# Altium schematic sheet Power Monitor.SchDoc
size A4; SheetNumber: 3; SheetTotal: 5
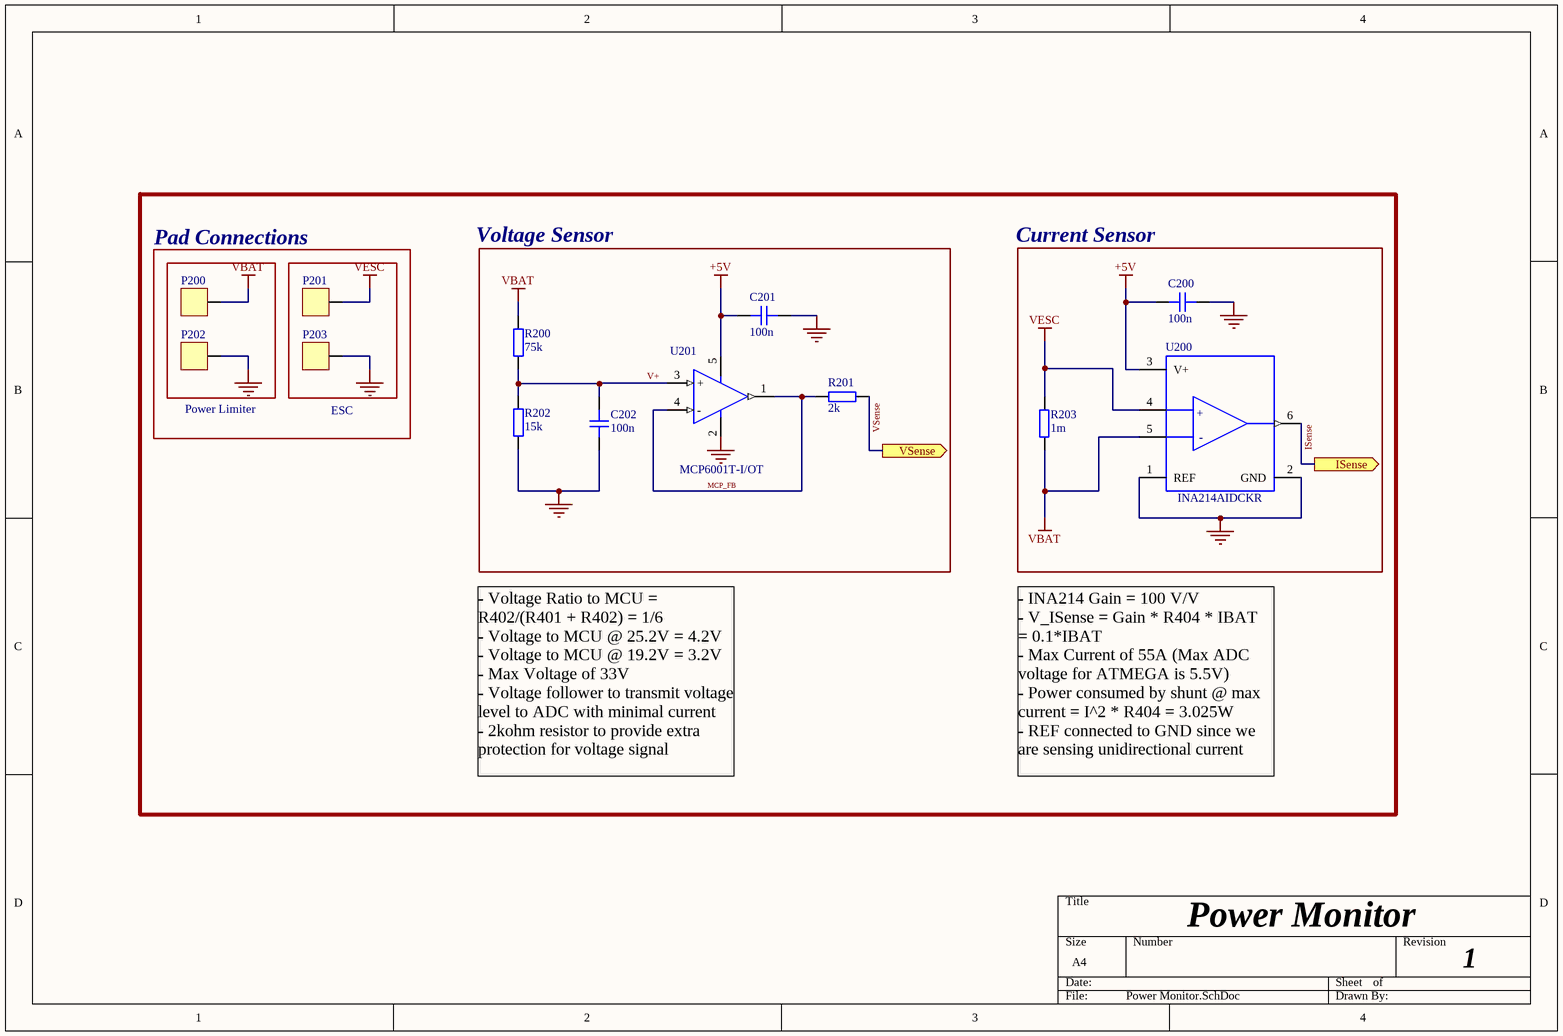
[diagram p0: Power Monitor.SchDoc]

## Parts
C200  100n  [CAP_0603]
C201  100n  [CAP_0603]
C202  100n  [CAP_0603]
P200  6mm x 6mm Solder Pad  [6mm x 6mm Solder Pad]  (value not drawn)
P201  6mm x 6mm Solder Pad  [6mm x 6mm Solder Pad]  (value not drawn)
P202  6mm x 6mm Solder Pad  [6mm x 6mm Solder Pad]  (value not drawn)
P203  6mm x 6mm Solder Pad  [6mm x 6mm Solder Pad]  (value not drawn)
R200  75k  [RES_0603]
R201  2k  [RES_0603]
R202  15k  [RES_0603]
R203  1m  [EBWM2512F1L00S9]
U200  INA214AIDCKR  [FP-DCK0006A-MFG]
U201  MCP6001T-I/OT  [MCP6001-I/OT]

## Blocks framed on the sheet
Voltage Sensor: C201 C202 R200-R202 U201
Pad Connections: P200-P203
Current Sensor: C200 R203 U200

## Ports
ISense (out, see Thrust Stand Controller Revised[3C], MCU[3B]), VSense (out, see Thrust Stand Controller Revised[3C], MCU[3C])

## Nets
+5V: C200.1 C201.1 U200.3(V+) U201.5
GND: C200.2 C201.2 C202.1 P202.1 P203.1 R202.2 U200.1(REF) U200.2(GND) U201.2
VBAT: P200.1 R200.1 R203.1 U200.5(IN-)
VESC: P201.1 R203.2 U200.4(IN+)
ISense: U200.6(VOUT) ; port ISense
MCP_FB: R201.1 U201.1 U201.4(-)
V+: C202.2 R200.2 R202.1 U201.3(+)
VSense: R201.2 ; port VSense

## Notes on the sheet
- (near P202) Power Limiter
- (near P203) ESC
- - Voltage Ratio to MCU = R402/(R401 + R402) = 1/6
  - Voltage to MCU @ 25.2V = 4.2V         - Voltage to MCU @ 19.2V = 3.2V            - Max Voltage of 33V                          - Voltage follower to transmit voltage level to ADC with minimal current                                                - 2kohm resistor to provide extra protection for voltage signal
- - INA214 Gain = 100 V/V
  - V_ISense = Gain * R404 * IBAT  = 0.1*IBAT                                               - Max Current of 55A (Max ADC voltage for ATMEGA is 5.5V)                                       - Power consumed by shunt @ max current = I^2 * R404 = 3.025W              - REF connected to GND since we are sensing unidirectional current
- Power Monitor
- 1
- (in symbol CMP-04910-000020-1) +; -

## Library data of the parts
C200-C202 = CAP_0603: Capacitor SMD 0603; Manufacturer: *; Manufacturer Part Number: *; Distributor Link: *; LCSC: *; Rating: *; Dielectric: *
R200-R202 = RES_0603: Resistor SMD 0603; Manufacturer: *; Manufacturer Part Number: *; Distributor Link: *; LCSC: *
R203 = EBWM2512F1L00S9: 6W 1mΩ Chip Current Sensing Resistors ±200ppm/℃ ±1% 2512 Current Sense Resistors / Shunt Resistors ROHS; Manufacturer: RESI; MFR. Part Number: EBWM2512F1L00S9; JLCPCB Part Number: C5224158; Package: 2512
U200 = CMP-04910-000020-1: IC CURRENT MONITOR 1% SC70-6 C105240; Manufacturer: Texas Instruments; Nominal Supply Current: 65uA; Number Of Outputs: 1; Min Supply Voltage: 2.7V; Max Junction Temp: +150°C; Max Supply Voltage: 26V; Standoff Height: 0mm; Lead Free: Yes; ComponentLink2Description: Datasheet; RoHS: TRUE; Package: DCK0006A; Mouser Description: SP Amp Current Shunt Monitor Single 26V 6-Pin SC-70 T/R; Manufacturer Part Number: INA214AIDCKR; Height: 1.1mm; Digikey Description: IC CURRENT MONITOR 1% SC70-6; Device Class L3: unset; Temperature Range Low: -40°C; Temperature Range High: +125°C; Ambient Temperature Range High: +125°C; Category: IC; Automotive: No; ComponentLink2URL: https://upverter.com/datasheet/f6da55a9132a31e577acef2c31156b568e2be49f.pdf; Device Class L1: Integrated Circuits (ICs); Temperature: -40°C to +125°C; Ambient Temperature Range Low: -40°C; Octopart: https://octopart.com/ina214aidckr-texas+instruments-12190780; Device Class L2: Power Management ICs
U201 = MCP6001T-I/OT: Supplier 1: Future Electronics; Supplier Part Number 1: 6195473